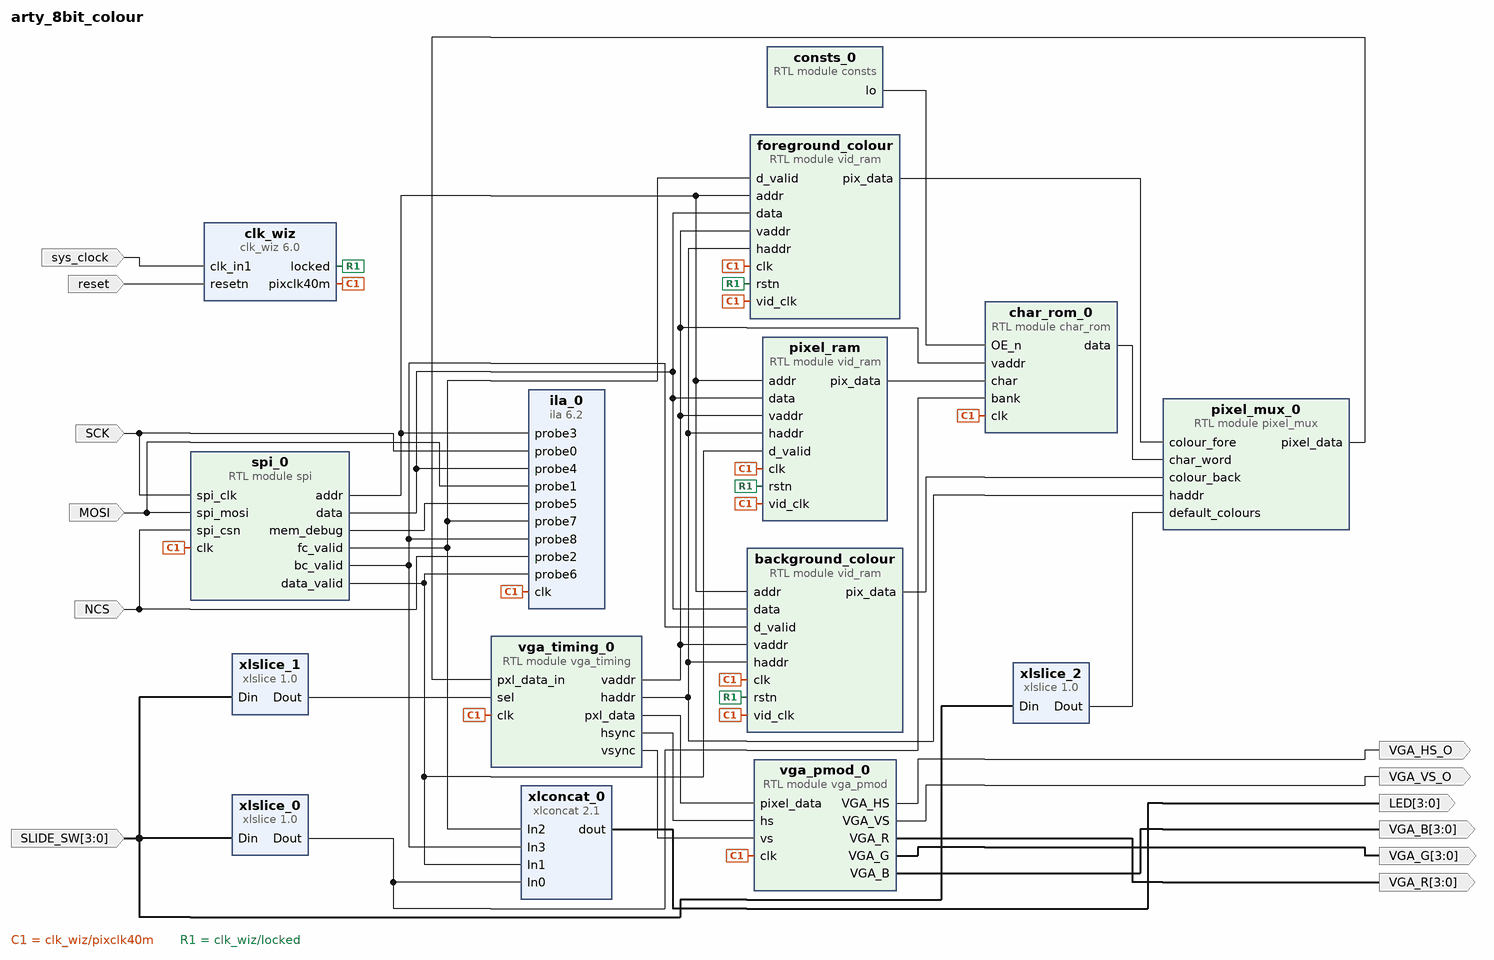
[diagram p0: block diagram of the top level]
# Vivado block design arty_8bit_colour, xc7a35ticsg324-1L, Vivado 2020.2
create_bd_design arty_8bit_colour

create_bd_port -dir I -type clk sys_clock
set_property -dict {CONFIG.FREQ_HZ 100000000 CONFIG.PHASE 0.000} [get_bd_ports sys_clock]
create_bd_port -dir O -from 3 -to 0 -type data VGA_G
create_bd_port -dir O -from 3 -to 0 VGA_R
create_bd_port -dir O -from 3 -to 0 VGA_B
create_bd_port -dir O VGA_HS_O
create_bd_port -dir O VGA_VS_O
create_bd_port -dir I -type rst reset
set_property -dict {CONFIG.POLARITY ACTIVE_LOW} [get_bd_ports reset]
create_bd_port -dir O -from 3 -to 0 LED
create_bd_port -dir I -from 3 -to 0 SLIDE_SW
create_bd_port -dir I -type clk SCK
set_property -dict {CONFIG.FREQ_HZ 1000000} [get_bd_ports SCK]
create_bd_port -dir I -type data MOSI
create_bd_port -dir I NCS

create_bd_cell -type ip -vlnv xilinx.com:ip:clk_wiz:6.0 clk_wiz
set_property -dict [list \
  CONFIG.CLKOUT1_JITTER 159.371 \
  CONFIG.CLKOUT1_REQUESTED_OUT_FREQ 40 \
  CONFIG.CLK_IN1_BOARD_INTERFACE sys_clock \
  CONFIG.CLK_OUT1_PORT pixclk40m \
  CONFIG.MMCM_CLKOUT0_DIVIDE_F 25.000 \
  CONFIG.RESET_BOARD_INTERFACE reset \
  CONFIG.RESET_PORT resetn \
  CONFIG.RESET_TYPE ACTIVE_LOW \
  CONFIG.USE_BOARD_FLOW true \
  CONFIG.USE_RESET true \
] [get_bd_cells clk_wiz]
create_bd_cell -type module -reference vga_pmod vga_pmod_0
create_bd_cell -type ip -vlnv xilinx.com:ip:xlconcat:2.1 xlconcat_0
set_property -dict [list \
  CONFIG.IN0_WIDTH 1 \
  CONFIG.IN1_WIDTH 1 \
  CONFIG.IN2_WIDTH 1 \
  CONFIG.IN3_WIDTH 1 \
  CONFIG.NUM_PORTS 4 \
] [get_bd_cells xlconcat_0]
create_bd_cell -type ip -vlnv xilinx.com:ip:xlslice:1.0 xlslice_0
set_property -dict {CONFIG.DIN_WIDTH 4} [get_bd_cells xlslice_0]
create_bd_cell -type module -reference consts consts_0
set_property -dict {CONFIG.FG_COL {"11111111"}} [get_bd_cells consts_0]
create_bd_cell -type module -reference char_rom char_rom_0
create_bd_cell -type ip -vlnv xilinx.com:ip:xlslice:1.0 xlslice_1
set_property -dict {CONFIG.DIN_FROM 1 CONFIG.DIN_TO 1 CONFIG.DIN_WIDTH 4 CONFIG.DOUT_WIDTH 1} [get_bd_cells xlslice_1]
create_bd_cell -type module -reference vid_ram pixel_ram
create_bd_cell -type module -reference vga_timing vga_timing_0
create_bd_cell -type ip -vlnv xilinx.com:ip:ila:6.2 ila_0
set_property -dict [list \
  CONFIG.C_DATA_DEPTH 32768 \
  CONFIG.C_ENABLE_ILA_AXI_MON false \
  CONFIG.C_MONITOR_TYPE Native \
  CONFIG.C_NUM_OF_PROBES 9 \
  CONFIG.C_PROBE3_WIDTH 14 \
  CONFIG.C_PROBE4_WIDTH 8 \
  CONFIG.C_PROBE5_WIDTH 2 \
] [get_bd_cells ila_0]
create_bd_cell -type module -reference vid_ram foreground_colour
create_bd_cell -type module -reference vid_ram background_colour
create_bd_cell -type ip -vlnv xilinx.com:ip:xlslice:1.0 xlslice_2
set_property -dict {CONFIG.DIN_FROM 2 CONFIG.DIN_TO 2 CONFIG.DIN_WIDTH 4 CONFIG.DOUT_WIDTH 1} [get_bd_cells xlslice_2]
create_bd_cell -type module -reference pixel_mux pixel_mux_0
create_bd_cell -type module -reference spi spi_0

# ---- connections ----

connect_bd_net [get_bd_ports sys_clock] [get_bd_pins clk_wiz/clk_in1]
connect_bd_net -net clk_wiz_pixclk50m [get_bd_pins clk_wiz/pixclk40m] \
  [get_bd_pins vga_pmod_0/clk] [get_bd_pins char_rom_0/clk] [get_bd_pins pixel_ram/vid_clk] [get_bd_pins pixel_ram/clk] \
  [get_bd_pins vga_timing_0/clk] [get_bd_pins ila_0/clk] [get_bd_pins foreground_colour/vid_clk] \
  [get_bd_pins background_colour/vid_clk] [get_bd_pins foreground_colour/clk] [get_bd_pins background_colour/clk] \
  [get_bd_pins spi_0/clk]
connect_bd_net [get_bd_pins vga_timing_0/pxl_data] [get_bd_pins vga_pmod_0/pixel_data]
connect_bd_net [get_bd_pins vga_pmod_0/VGA_VS] [get_bd_ports VGA_VS_O]
connect_bd_net [get_bd_pins vga_pmod_0/VGA_HS] [get_bd_ports VGA_HS_O]
connect_bd_net [get_bd_pins vga_pmod_0/VGA_R] [get_bd_ports VGA_R]
connect_bd_net [get_bd_pins vga_pmod_0/VGA_G] [get_bd_ports VGA_G]
connect_bd_net [get_bd_pins vga_pmod_0/VGA_B] [get_bd_ports VGA_B]
connect_bd_net [get_bd_ports reset] [get_bd_pins clk_wiz/resetn]
connect_bd_net -net vram_0_data_out [get_bd_pins pixel_mux_0/pixel_data] [get_bd_pins vga_timing_0/pxl_data_in]
connect_bd_net [get_bd_pins vga_timing_0/hsync] [get_bd_pins vga_pmod_0/hs]
connect_bd_net [get_bd_pins vga_timing_0/vsync] [get_bd_pins vga_pmod_0/vs]
connect_bd_net [get_bd_pins xlconcat_0/dout] [get_bd_ports LED]
connect_bd_net [get_bd_pins clk_wiz/locked] [get_bd_pins pixel_ram/rstn] [get_bd_pins foreground_colour/rstn] [get_bd_pins background_colour/rstn]
connect_bd_net [get_bd_ports SLIDE_SW] [get_bd_pins xlslice_0/Din] [get_bd_pins xlslice_1/Din] [get_bd_pins xlslice_2/Din]
connect_bd_net -net sw0net [get_bd_pins xlslice_0/Dout] [get_bd_pins xlconcat_0/In0] [get_bd_pins char_rom_0/bank]
connect_bd_net [get_bd_pins consts_0/lo] [get_bd_pins char_rom_0/OE_n]
connect_bd_net [get_bd_pins vga_timing_0/haddr] \
  [get_bd_pins pixel_ram/haddr] [get_bd_pins foreground_colour/haddr] [get_bd_pins background_colour/haddr] \
  [get_bd_pins pixel_mux_0/haddr]
connect_bd_net [get_bd_pins char_rom_0/data] [get_bd_pins pixel_mux_0/char_word]
connect_bd_net [get_bd_pins vga_timing_0/vaddr] \
  [get_bd_pins char_rom_0/vaddr] [get_bd_pins pixel_ram/vaddr] [get_bd_pins foreground_colour/vaddr] \
  [get_bd_pins background_colour/vaddr]
connect_bd_net -net vid_ram_0_pix_data [get_bd_pins pixel_ram/pix_data] [get_bd_pins char_rom_0/char]
connect_bd_net [get_bd_pins xlslice_1/Dout] [get_bd_pins vga_timing_0/sel]
connect_bd_net [get_bd_pins spi_0/addr] \
  [get_bd_pins pixel_ram/addr] [get_bd_pins foreground_colour/addr] [get_bd_pins background_colour/addr] \
  [get_bd_pins ila_0/probe3]
connect_bd_net [get_bd_pins spi_0/data] \
  [get_bd_pins pixel_ram/data] [get_bd_pins foreground_colour/data] [get_bd_pins background_colour/data] \
  [get_bd_pins ila_0/probe4]
connect_bd_net [get_bd_pins spi_0/data_valid] [get_bd_pins pixel_ram/d_valid] [get_bd_pins xlconcat_0/In1] [get_bd_pins ila_0/probe6]
connect_bd_net [get_bd_ports SCK] [get_bd_pins ila_0/probe0] [get_bd_pins spi_0/spi_clk]
connect_bd_net [get_bd_ports MOSI] [get_bd_pins ila_0/probe1] [get_bd_pins spi_0/spi_mosi]
connect_bd_net [get_bd_ports NCS] [get_bd_pins ila_0/probe2] [get_bd_pins spi_0/spi_csn]
connect_bd_net [get_bd_pins spi_0/fc_valid] [get_bd_pins foreground_colour/d_valid] [get_bd_pins xlconcat_0/In2] [get_bd_pins ila_0/probe7]
connect_bd_net [get_bd_pins spi_0/bc_valid] [get_bd_pins background_colour/d_valid] [get_bd_pins xlconcat_0/In3] [get_bd_pins ila_0/probe8]
connect_bd_net [get_bd_pins background_colour/pix_data] [get_bd_pins pixel_mux_0/colour_back]
connect_bd_net [get_bd_pins spi_0/mem_debug] [get_bd_pins ila_0/probe5]
connect_bd_net [get_bd_pins foreground_colour/pix_data] [get_bd_pins pixel_mux_0/colour_fore]
connect_bd_net [get_bd_pins xlslice_2/Dout] [get_bd_pins pixel_mux_0/default_colours]

validate_bd_design
save_bd_design
